# Altium schematic sheet Sheet1.SchDoc
size A0; SheetNumber: 1; SheetTotal: 1
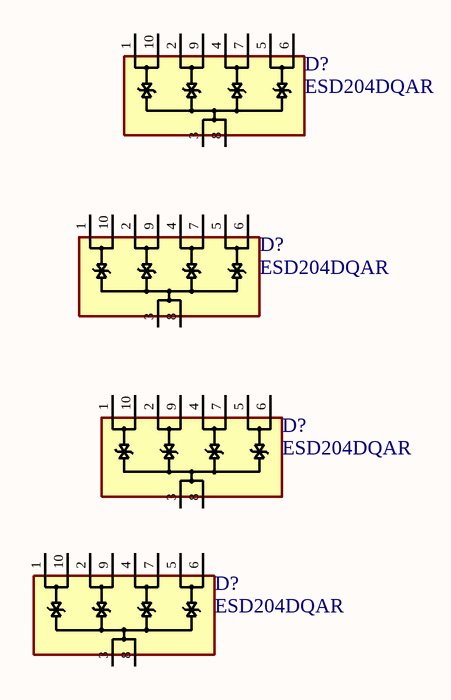
[diagram p0: Sheet1.SchDoc]

## Parts
(Parts that share a designator on the sheet are numbered #1, #2 ... from top to bottom, then left to right.)
D?#1  ESD204DQAR  [DQA0010A]
D?#2  ESD204DQAR  [DQA0010A]
D?#3  ESD204DQAR  [DQA0010A]
D?#4  ESD204DQAR  [DQA0010A]

## Nets

Not connected (* = marked no-connect by the designer): D?#1 1(IO1) 2(IO2) 3(GND_3) 4(IO3) 5(IO4) 6(NC_6) 7(NC_7) 8(GND_8) 9(NC_9) 10(NC_10); D?#2 1(IO1) 2(IO2) 3(GND_3) 4(IO3) 5(IO4) 6(NC_6) 7(NC_7) 8(GND_8) 9(NC_9) 10(NC_10); D?#3 1(IO1) 2(IO2) 3(GND_3) 4(IO3) 5(IO4) 6(NC_6) 7(NC_7) 8(GND_8) 9(NC_9) 10(NC_10); D?#4 1(IO1) 2(IO2) 3(GND_3) 4(IO3) 5(IO4) 6(NC_6) 7(NC_7) 8(GND_8) 9(NC_9) 10(NC_10)

## Library data of the parts
D?#1-D?#4 = ESD204DQAR: ESD Protection Diodes / TVS Diodes Quad 0.55-pF +/-3.6 -V +/-30-kV ESD pro; Manufacter: Texas Instruments; Montagem: SMD; Breakdown Voltage: 7.9 V; Peak Pulse Current: 5.5 A; Peak Pulse Power Dissipation: 50 W; Part Number: ESD204DQAR; Nome: ESD204DQAR; Bidirecional/Unidirecional: ESD204DQAR; Package: DQA0010A; Supplier 1: Mouser; Supplier Part Number 1: 595-ESD204DQAR; Supplier 2: Digikey; Supplier Part Number 2: 296-49504-1-ND; Supplier 3: LCSC; Supplier Part Number 3: C553132